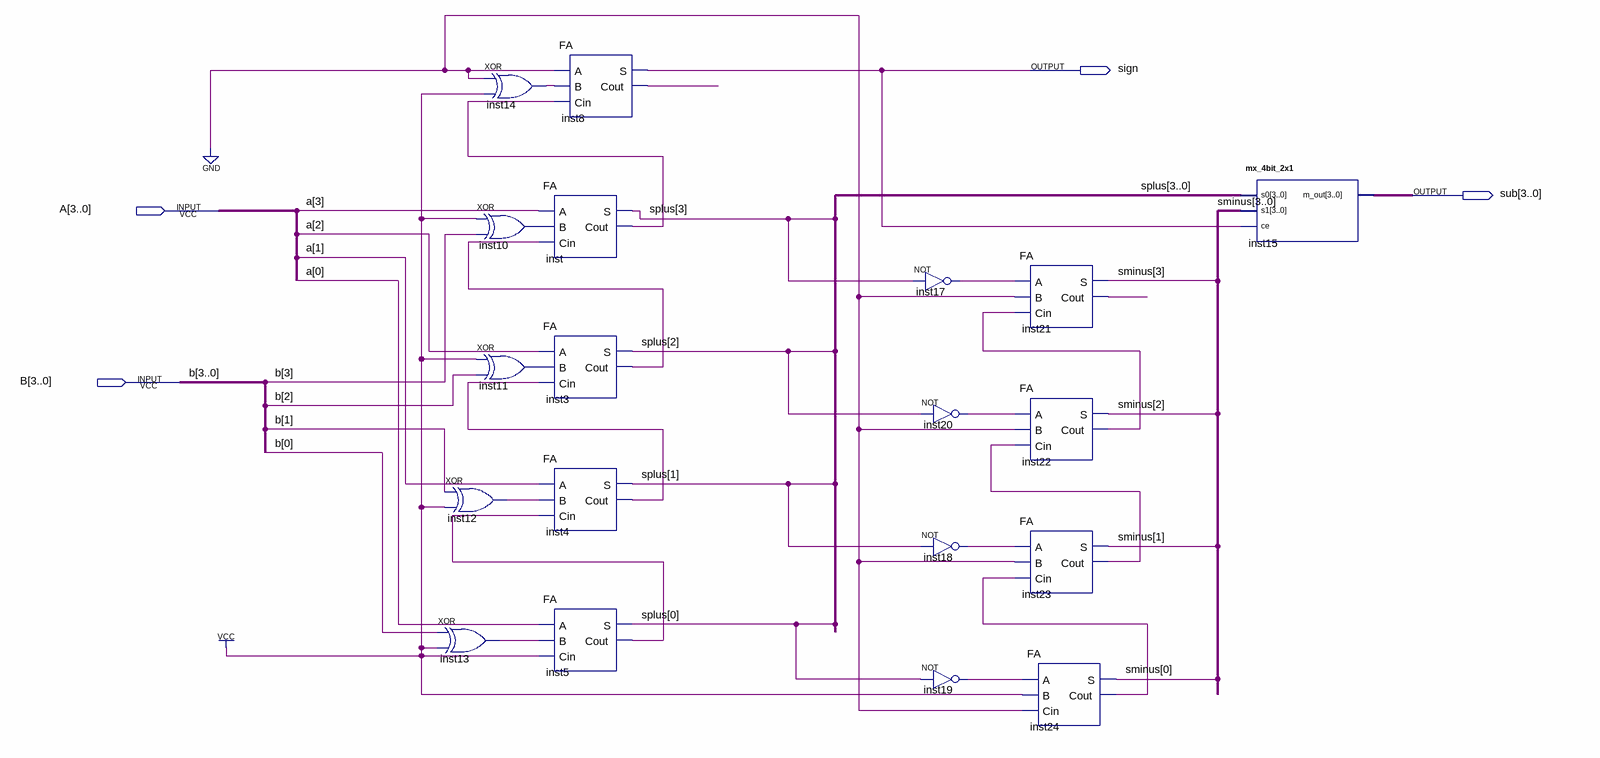
[diagram p0: schematic sheet]
// Quartus schematic sub.bdf as structural Verilog: 19 symbols, 4 pins
module sub (
  input  [3:0] A,
  input  [3:0] B,
  output sign,
  output [3:0] sub
);

  wire inst3_cout, inst4_cout, inst5_cout, inst8_cout, inst10_out, inst11_out, inst12_out, inst13_out,
       inst14_out, inst17_out, inst18_out, inst19_out, inst20_out, inst21_cout, inst22_cout, inst23_cout,
       inst24_cout, inst_cout;
  wire [3:0] sminus, splus;

  xor inst13 (inst13_out, B[0], 1'b1);
  xor inst14 (inst14_out, 1'b0, 1'b1);
  xor inst10 (inst10_out, 1'b1, B[3]);
  xor inst11 (inst11_out, 1'b1, B[2]);
  xor inst12 (inst12_out, B[1], 1'b1);
  FA inst8 (.A(1'b0), .B(inst14_out), .Cin(inst_cout), .S(sign), .Cout(inst8_cout));
  FA inst (.A(A[3]), .B(inst10_out), .Cin(inst3_cout), .S(splus[3]), .Cout(inst_cout));
  FA inst3 (.A(A[2]), .B(inst11_out), .Cin(inst4_cout), .S(splus[2]), .Cout(inst3_cout));
  FA inst4 (.A(A[1]), .B(inst12_out), .Cin(inst5_cout), .S(splus[1]), .Cout(inst4_cout));
  FA inst5 (.A(A[0]), .B(inst13_out), .Cin(1'b1), .S(splus[0]), .Cout(inst5_cout));
  not inst17 (inst17_out, splus[3]);
  not inst20 (inst20_out, splus[2]);
  not inst18 (inst18_out, splus[1]);
  not inst19 (inst19_out, splus[0]);
  FA inst21 (.A(inst17_out), .B(1'b0), .Cin(inst22_cout), .S(sminus[3]), .Cout(inst21_cout));
  FA inst22 (.A(inst20_out), .B(1'b0), .Cin(inst23_cout), .S(sminus[2]), .Cout(inst22_cout));
  FA inst23 (.A(inst18_out), .B(1'b0), .Cin(inst24_cout), .S(sminus[1]), .Cout(inst23_cout));
  FA inst24 (.A(inst19_out), .B(1'b1), .Cin(1'b0), .S(sminus[0]), .Cout(inst24_cout));
  mx_4bit_2x1 inst15 (.s0(splus), .s1(sminus), .ce(sign), .m_out(sub));
endmodule
